# Altium schematic sheet SCH.SchDoc
size A3
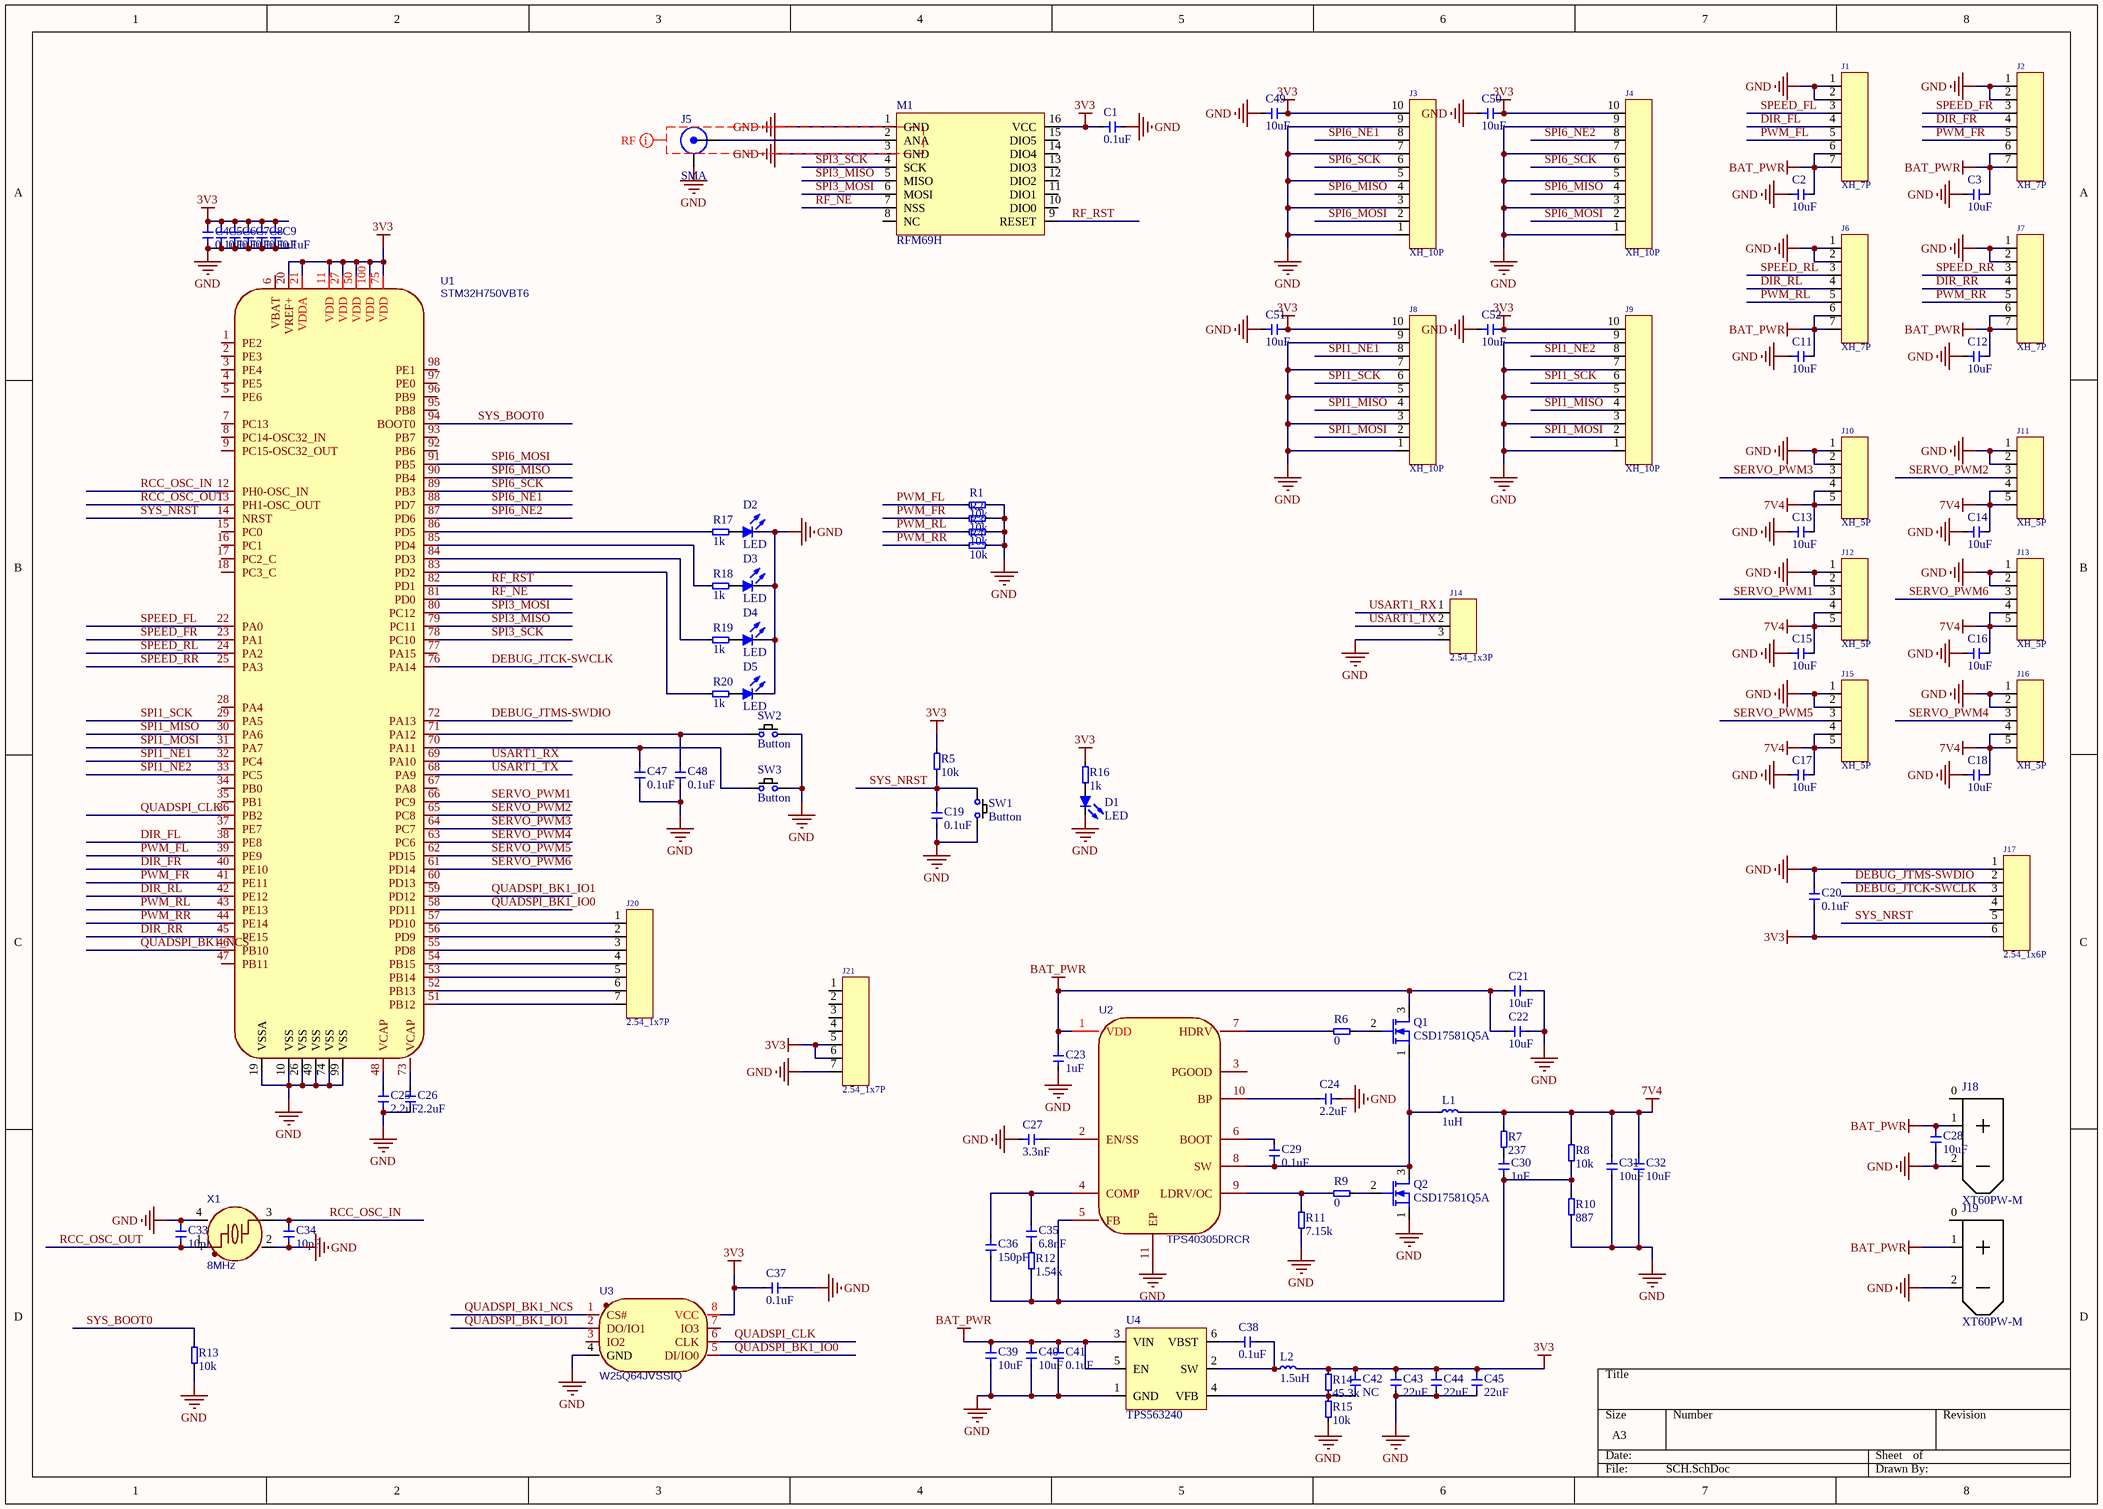
[diagram p0: SCH.SchDoc]

## Parts
C1  0.1uF  [0402]
C2  10uF  [0805]
C3  10uF  [0805]
C4  0.1uF  [0402]
C5  0.1uF  [0402]
C6  0.1uF  [0402]
C7  0.1uF  [0402]
C8  0.1uF  [0402]
C9  0.1uF  [0402]
C11  10uF  [0805]
C12  10uF  [0805]
C13  10uF  [0805]
C14  10uF  [0805]
C15  10uF  [0805]
C16  10uF  [0805]
C17  10uF  [0805]
C18  10uF  [0805]
C19  0.1uF  [0402]
C20  0.1uF  [0402]
C21  10uF  [0805]
C22  10uF  [0805]
C23  1uF  [0603]
C24  2.2uF  [0603]
C25  2.2uF  [0402]
C26  2.2uF  [0402]
C27  3.3nF  [0402]
C28  10uF  [0805]
C29  0.1uF  [0805]
C30  1nF  [0402]
C31  10uF  [0805]
C32  10uF  [0805]
C33  10pF  [0402]
C34  10pF  [0402]
C35  6.8nF  [0402]
C36  150pF  [0402]
C37  0.1uF  [0402]
C38  0.1uF  [0603]
C39  10uF  [0805]
C40  10uF  [0805]
C41  0.1uF  [0603]
C42  NC  [0402]
C43  22uF  [0603]
C44  22uF  [0603]
C45  22uF  [0603]
C47  0.1uF  [0402]
C48  0.1uF  [0402]
C49  10uF  [0603]
C50  10uF  [0603]
C51  10uF  [0603]
C52  10uF  [0603]
D1  LED  [0603LED]
D2  LED  [0603LED]
D3  LED  [0603LED]
D4  LED  [0603LED]
D5  LED  [0603LED]
J1  XH_7P  [XH_7P直插立式]
J2  XH_7P  [XH_7P直插立式]
J3  XH_10P  [XH_10P直插立式]
J4  XH_10P  [XH_10P直插立式]
J5  SMA  [SMA_Edge]
J6  XH_7P  [XH_7P直插立式]
J7  XH_7P  [XH_7P直插立式]
J8  XH_10P  [XH_10P直插立式]
J9  XH_10P  [XH_10P直插立式]
J10  XH_5P  [XH_5P直插立式]
J11  XH_5P  [XH_5P直插立式]
J12  XH_5P  [XH_5P直插立式]
J13  XH_5P  [XH_5P直插立式]
J14  2.54_1x3P  [2.54排针_1x3立式]
J15  XH_5P  [XH_5P直插立式]
J16  XH_5P  [XH_5P直插立式]
J17  2.54_1x6P  [2.54排针_1x6立式]
J18  XT60PW-M  [XT60PW-M20]
J19  XT60PW-M  [XT60PW-M20]
J20  2.54_1x7P  [2.54排针_1x7立式]
J21  2.54_1x7P  [2.54排针_1x7立式]
L1  1uH  [IND-SMD_L11.5-W10.5_1004]
L2  1.5uH  [IND-SMD_L7.1-W6.6_0630]
M1  RFM69H  [RFM69H]
Q1  CSD17581Q5A  [SON-8_L5.0-W6.0-P1.27-BL_MOSFET]
Q2  CSD17581Q5A  [SON-8_L5.0-W6.0-P1.27-BL_MOSFET]
R1  10k  [0402]
R2  10k  [0402]
R3  10k  [0402]
R4  10k  [0402]
R5  10k  [0402]
R6  0  [0402]
R7  237  [0402]
R8  10k  [0402]
R9  0  [0402]
R10  887  [0402]
R11  7.15k  [0402]
R12  1.54k  [0402]
R13  10k  [0402]
R14  45.3k  [0402]
R15  10k  [0402]
R16  1k  [0402]
R17  1k  [0402]
R18  1k  [0402]
R19  1k  [0402]
R20  1k  [0402]
SW1  Button  [KEY-SMD_4P-L6.0-W6.0-P4.50-LS8.6]
SW2  Button  [KEY-SMD_4P-L6.0-W6.0-P4.50-LS8.6]
SW3  Button  [KEY-SMD_4P-L6.0-W6.0-P4.50-LS8.6]
U1  STM32H750VBT6  [LQFP-100_L14.0-W14.0-P0.50-LS16.0-BL]
U2  TPS40305DRCR  [VSON-10_L3.0-W3.0-P0.50-TL-EP]
U3  W25Q64JVSSIQ  [SOP-8_L5.3-W5.3-P1.27-LS8.0-BL]
U4  TPS563240  [SOT-23-6_L2.9-W1.6-P0.95-LS2.8-BR]
X1  8MHz  [OSC-SMD_4P-L3.2-W2.5-BL]

## Nets
3V3: C1.2 C4.2 C5.2 C6.2 C7.2 C8.2 C9.2 C20.1 C37.1 C42.2 C43.2 C44.2 C45.2 C49.2 C50.2 C51.2 C52.2 J3.10 J4.10 J8.10 J9.10 J17.6 J21.5 J21.6 L2.2 M1.16(VCC) R5.2 R14.2 R16.2 U1.11(VDD) U1.20(VREF+) U1.21(VDDA) U1.27(VDD) U1.50(VDD) U1.75(VDD) U1.100(VDD) U3.8(VCC)
7V4: C13.2 C14.2 C15.2 C16.2 C17.2 C18.2 C31.1 C32.1 J10.4 J10.5 J11.4 J11.5 J12.4 J12.5 J13.4 J13.5 J15.4 J15.5 J16.4 J16.5 L1.2 R7.2 R8.2
BAT_PWR: C2.2 C3.2 C11.2 C12.2 C21.2 C22.2 C23.2 C28.1 C39.2 C40.2 C41.1 J1.6 J1.7 J2.6 J2.7 J6.6 J6.7 J7.6 J7.7 J18.1 J19.1 Q1.3(D) U2.1(VDD) U4.3(VIN) U4.5(EN)
GND: C1.1 C2.1 C3.1 C4.1 C5.1 C6.1 C7.1 C8.1 C9.1 C11.1 C12.1 C13.1 C14.1 C15.1 C16.1 C17.1 C18.1 C19.1 C20.2 C21.1 C22.1 C23.1 C24.2 C25.1 C26.1 C27.2 C28.2 C31.2 C32.2 C33.2 C34.1 C37.2 C39.1 C40.1 C41.2 C43.1 C44.1 C45.1 C47.2 C48.2 C49.1 C50.1 C51.1 C52.1 D1.K D2.K D3.K D4.K D5.K J1.1 J1.2 J2.1 J2.2 J3.1 J3.3 J3.5 J3.7 J3.9 J4.1 J4.3 J4.5 J4.7 J4.9 J5.2 J6.1 J6.2 J7.1 J7.2 J8.1 J8.3 J8.5 J8.7 J8.9 J9.1 J9.3 J9.5 J9.7 J9.9 J10.1 J10.2 J11.1 J11.2 J12.1 J12.2 J13.1 J13.2 J14.3 J15.1 J15.2 J16.1 J16.2 J17.1 J18.2 J19.2 J21.7 M1.1(GND) M1.3(GND) Q2.1(S) R1.2 R2.2 R3.2 R4.2 R10.1 R11.1 R13.1 R15.1 SW1.2 SW2.2 SW3.2 U1.10(VSS) U1.19(VSSA) U1.26(VSS) U1.49(VSS) U1.74(VSS) U1.99(VSS) U2.11(EP) U3.4(GND) U4.1(GND) X1.2(GND) X1.4(GND)
DEBUG_JTCK-SWCLK: J17.3 U1.76(PA14)
DEBUG_JTMS-SWDIO: J17.2 U1.72(PA13)
DIR_FL: J1.4 U1.38(PE8)
DIR_FR: J2.4 U1.40(PE10)
DIR_RL: J6.4 U1.42(PE12)
DIR_RR: J7.4 U1.45(PE15)
PWM_FL: J1.5 R1.1 U1.39(PE9)
PWM_FR: J2.5 R2.1 U1.41(PE11)
PWM_RL: J6.5 R3.1 U1.43(PE13)
PWM_RR: J7.5 R4.1 U1.44(PE14)
QUADSPI_BK1_IO0: U1.58(PD11) U3.5(DI/IO0)
QUADSPI_BK1_IO1: U1.59(PD12) U3.2(DO/IO1)
QUADSPI_BK1_NCS: U1.46(PB10) U3.1(CS#)
QUADSPI_CLK: U1.36(PB2) U3.6(CLK)
RCC_OSC_IN: C34.2 U1.12(PH0-OSC_IN) X1.3
RCC_OSC_OUT: C33.1 U1.13(PH1-OSC_OUT) X1.1
RF_NE: M1.7(NSS) U1.81(PD0)
RF_RST: M1.9(RESET) U1.82(PD1)
SERVO_PWM1: J12.3 U1.66(PC9)
SERVO_PWM2: J11.3 U1.65(PC8)
SERVO_PWM3: J10.3 U1.64(PC7)
SERVO_PWM4: J16.3 U1.63(PC6)
SERVO_PWM5: J15.3 U1.62(PD15)
SERVO_PWM6: J13.3 U1.61(PD14)
SPEED_FL: J1.3 U1.22(PA0)
SPEED_FR: J2.3 U1.23(PA1)
SPEED_RL: J6.3 U1.24(PA2)
SPEED_RR: J7.3 U1.25(PA3)
SPI1_MISO: J8.4 J9.4 U1.30(PA6)
SPI1_MOSI: J8.2 J9.2 U1.31(PA7)
SPI1_NE1: J8.8 U1.32(PC4)
SPI1_NE2: J9.8 U1.33(PC5)
SPI1_SCK: J8.6 J9.6 U1.29(PA5)
SPI3_MISO: M1.5(MISO) U1.79(PC11)
SPI3_MOSI: M1.6(MOSI) U1.80(PC12)
SPI3_SCK: M1.4(SCK) U1.78(PC10)
SPI6_MISO: J3.4 J4.4 U1.90(PB4)
SPI6_MOSI: J3.2 J4.2 U1.91(PB5)
SPI6_NE1: J3.8 U1.88(PD7)
SPI6_NE2: J4.8 U1.87(PD6)
SPI6_SCK: J3.6 J4.6 U1.89(PB3)
SYS_BOOT0: R13.2 U1.94(BOOT0)
SYS_NRST: C19.2 J17.5 R5.1 SW1.1 U1.14(NRST)
USART1_RX: J14.1 U1.69(PA10)
USART1_TX: J14.2 U1.68(PA9)
NetC24_1: C24.1 U2.10(BP)
NetC25_2: C25.2 U1.48(VCAP)
NetC26_2: C26.2 U1.73(VCAP)
NetC27_1: C27.1 U2.2(EN/SS)
NetC29_1: C29.1 U2.6(BOOT)
NetC29_2: C29.2 L1.1 Q1.1(S) Q2.3(D) U2.8(SW)
NetC30_1: C30.1 R7.1
NetC30_2: C30.2 C36.2 R8.1 R10.2 R12.1 U2.5(FB)
NetC35_1: C35.1 C36.1 U2.4(COMP)
NetC35_2: C35.2 R12.2
NetC38_1: C38.1 L2.1 U4.2(SW)
NetC38_2: C38.2 U4.6(VBST)
NetC42_1: C42.1 R14.1 R15.2 U4.4(VFB)
NetC47_1: C47.1 SW3.1 U1.70(PA11)
NetC48_1: C48.1 SW2.1 U1.71(PA12)
NetD1_A: D1.A R16.1
NetD2_A: D2.A R17.1
NetD3_A: D3.A R18.1
NetD4_A: D4.A R19.1
NetD5_A: D5.A R20.1
NetJ5_1: J5.1 M1.2(ANA)
NetJ20_1: J20.1 U1.57(PD10)
NetJ20_2: J20.2 U1.56(PD9)
NetJ20_3: J20.3 U1.55(PD8)
NetJ20_4: J20.4 U1.54(PB15)
NetJ20_5: J20.5 U1.53(PB14)
NetJ20_6: J20.6 U1.52(PB13)
NetJ20_7: J20.7 U1.51(PB12)
NetQ1_2: Q1.2(G) R6.2
NetQ2_2: Q2.2(G) R9.2
NetR6_1: R6.1 U2.7(HDRV)
NetR9_1: R9.1 R11.2 U2.9(LDRV/OC)
NetR17_2: R17.2 U1.86(PD5)
NetR18_2: R18.2 U1.85(PD4)
NetR19_2: R19.2 U1.84(PD3)
NetR20_2: R20.2 U1.83(PD2)

Not connected (* = marked no-connect by the designer): J17 4; J18 0; J19 0; J21 1 2 3 4; M1 8(NC) 10(DIO0) 11(DIO1) 12(DIO2) 13(DIO3) 14(DIO4) 15(DIO5); U1 1(PE2) 2(PE3) 3(PE4) 4(PE5) 5(PE6) 6(VBAT) 7(PC13) 8(PC14-OSC32_IN) 9(PC15-OSC32_OUT) 15(PC0) 16(PC1) 17(PC2_C) 18(PC3_C) 28(PA4) 34(PB0) 35(PB1) 37(PE7) 47(PB11) 60(PD13) 67(PA8) 77(PA15) 92(PB6) 93(PB7) 95(PB8) 96(PB9) 97(PE0) 98(PE1); U2 3(PGOOD); U3 3(IO2) 7(IO3)

## Layout directives
net class RF: GND

## Library data of the parts
C1-C9 C11-C45 C47-C52 = Cap
J5 = Coax
L1 L2 = Inductor
Q1 Q2 = MOS_N_SON8
R1-R20 = Res: Resistor
U1 = STM32H750VBT6: BOM_Manufacturer: STMicroelectronics; Contributor: LCSC; BOM_Paste Type: recommend; BOM_Supplier: LCSC; BOM_Supplier Part: C404010; BOM_Manufacturer Part: STM32H750VBT6; spicePre: U; spiceSymbolName: STM32H750VBT6
U2 = TPS40305DRCR: BOM_Manufacturer: Texas Instruments; Contributor: LCSC; BOM_Supplier: LCSC; BOM_Supplier Part: C140285; BOM_Manufacturer Part: TPS40305DRCR; spicePre: U; spiceSymbolName: TPS40305DRCR
U3 = W25Q64JVSSIQ: BOM_Manufacturer: WINBOND; BOM_Paste Type: recommend; BOM_Assembly Type: smtWeld; BOM_Supplier: LCSC; BOM_Manufacturer Part: W25Q64JVSSIQ; image: //image.lceda.cn/szlcsc/C83140.jpg; BOM_Supplier Part: C83140; spicePre: U; spiceSymbolName: W25Q64JVSSIQ
X1 = Crystal_4P: BOM_Manufacturer: Suzhou Liming Elec; BOM_Manufacturer Part: 3225-8.00-20-10-10/A; nameAlias: Frequency; Contributor: LCSC; BOM_Supplier: LCSC; BOM_Supplier Part: C518156; spicePre: X; spiceSymbolName: 3225-8.00-20-10-10/A